# Altium project IOElectro_SimpleOscilloscope.PrjPcb
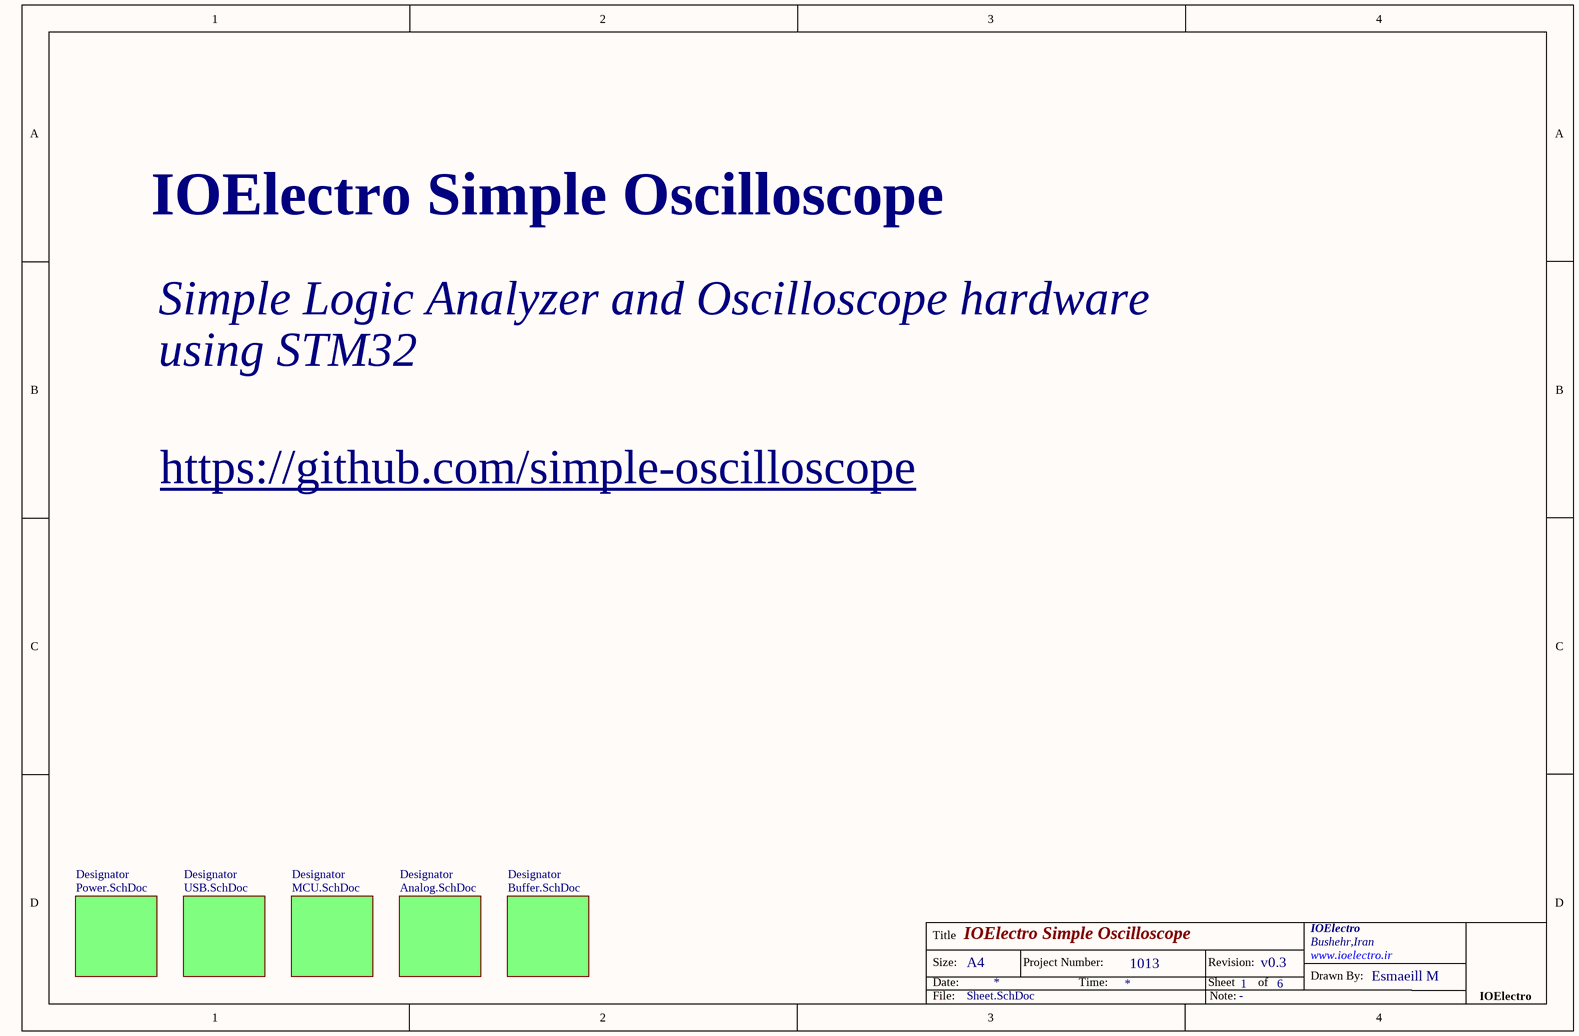
[diagram p0: Sheet.SchDoc]
NF: NF
6 sheets, 108 parts. Net scope: flat (ports and power ports of the same name join across sheets).
Board file: PCB.PcbDoc
Sheets:
  Sheet.SchDoc
    Designator = Power.SchDoc
    Designator = USB.SchDoc
    Designator = MCU.SchDoc
    Designator = Analog.SchDoc
    Designator = Buffer.SchDoc

## Sheet Sheet.SchDoc: IOElectro Simple Oscilloscope
size A4; Author: -; CompanyName: IOElectro; DrawnBy: Esmaeill M; Engineer: -; Organization: IOElectro; Address1: Bushehr,Iran; Address2: www.ioelectro.ir; DocumentNumber: 1; Revision: v0.3; SheetNumber: 1; SheetTotal: 6; ProjectNumber: 1013; Note: -

### Sub-sheets
Designator = Power.SchDoc: no entries
Designator = USB.SchDoc: no entries
Designator = MCU.SchDoc: no entries
Designator = Analog.SchDoc: no entries
Designator = Buffer.SchDoc: no entries

### Notes on the sheet
- IOElectro Simple Oscilloscope
- Simple Logic Analyzer and Oscilloscope hardware
- using STM32
- https://github.com/simple-oscilloscope
- Title
- Size:
- Date:
- A4
- Project Number:
- Time:
- Revision:
- Sheet
- of
- Drawn By:
- IOElectro
- File:
- Note:

## Sheet Power.SchDoc: POWER
size A4; Author: -; CompanyName: IOElectro; DrawnBy: Esmaeill M; Engineer: -; Organization: IOElectro; Address1: Bushehr,Iran; Address2: www.ioelectro.ir; DocumentNumber: 2; Revision: v0.3; SheetNumber: 2; SheetTotal: 6; ProjectNumber: 1013; Note: POWER
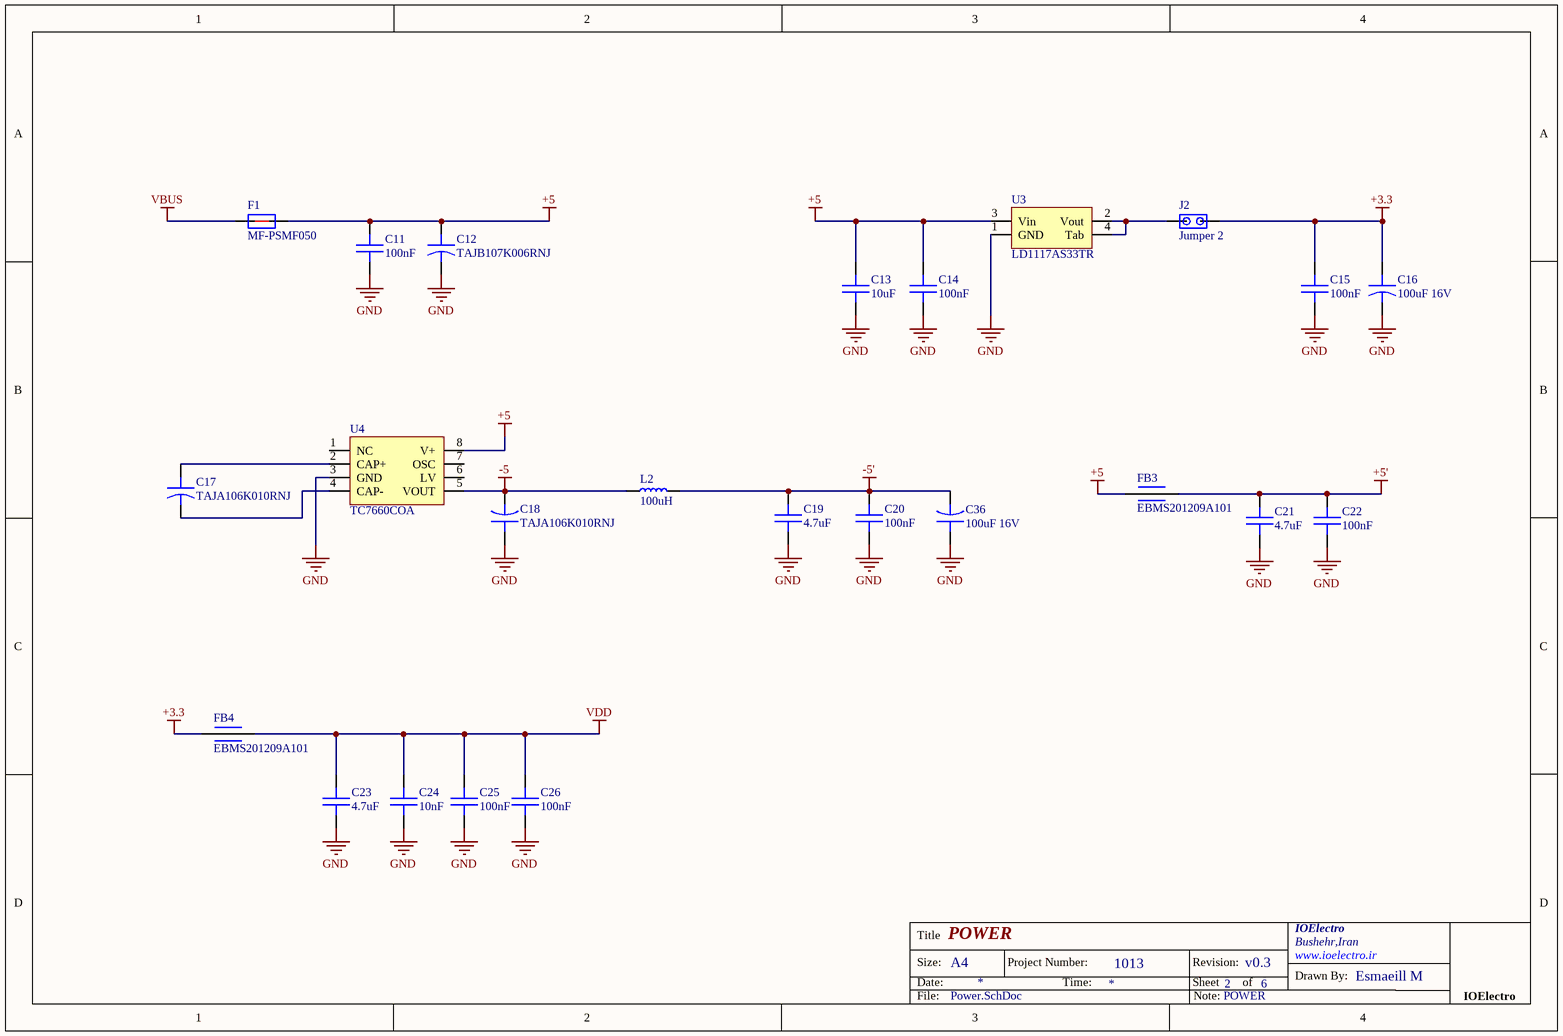
[diagram p1: Power.SchDoc]

### Parts
C11  100nF  [C-0805]
C12  TAJB107K006RNJ  [TAJB]
C13  10uF  [C-0805]
C14  100nF  [C-0805]
C15  100nF  [C-0805]
C16  100uF 16V  [C-EL_6.5x7x2.5mm]
C17  TAJA106K010RNJ  [TAJA]
C18  TAJA106K010RNJ  [TAJA]
C19  4.7uF  [C-0805]
C20  100nF  [C-BP-Ceramic-DIP]
C21  4.7uF  [C-0805]
C22  100nF  [C-BP-Ceramic-DIP]
C23  4.7uF  [C-0805]
C24  10nF  [C-0805]
C25  100nF  [C-0805]
C26  100nF  [C-0805]
C36  100uF 16V  [C-EL_6.5x7x2.5mm]
F1  MF-PSMF050  [MF-PSMF]
FB3  EBMS201209A101  [L-0805]
FB4  EBMS201209A101  [L-0805]
J2  Jumper 2  [JAMPER-2-DIP_2.56mm]
L2  100uH  [L-DIP_3x7mm_pin9mm]
U3  LD1117AS33TR  [SOT-223]
U4  TC7660COA  [SOIC-8]

### Nets
+3.3: C15.1 C16.A FB4.1 J2.1
+5: C11.1 C12.A C13.1 C14.1 F1.2 FB3.1 U3.3(Vin) U4.8(V+)
+5': C21.1 C22.2 FB3.2
-5: C18.K L2.1 U4.5(VOUT)
-5': C19.1 C20.2 C36.K L2.2
GND: C11.2 C12.K C13.2 C14.2 C15.2 C16.K C18.A C19.2 C20.1 C21.2 C22.1 C23.2 C24.2 C25.2 C26.2 C36.A U3.1(GND) U4.3(GND)
VBUS: F1.1
VDD: C23.1 C24.1 C25.1 C26.1 FB4.2
NetC17_A: C17.A U4.2(CAP+)
NetC17_K: C17.K U4.4(CAP-)
NetJ2_2: J2.2 U3.2(Vout) U3.4(Tab)

Not connected (* = marked no-connect by the designer): U4 1(NC) 6(LV) 7(OSC)

### Notes on the sheet
- Title
- Size:
- Date:
- A4
- Project Number:
- Time:
- Revision:
- Sheet
- of
- Drawn By:
- IOElectro
- File:
- Note:

### Library data of the parts
C11 C13-C15 C19 C21 C23-C26 = CAP: SMD 0805
C12 = TAJB107K006RNJ: AVX - TAJB107K006RNJ - Surface Mount Tantalum Capacitor, 100 µF, 6.3 V, 1411 [3528 Metric], TAJ Series, ± 10%, -55 °C; Manufacturer: Kyocera AVX; Capacitance: 100uF; ESR (Equivalent Series Resistance): 1.7R; Voltage Rating (DC): 6.3V; Leakage Current: 6.3uA; Polarity: Polar; Supplier 1: Digi-Key; Manufacturer Part Number: TAJB107K006RNJ; RoHS: Yes; Category: Tantalum Capacitors; Stock 1: 10000; Pricing 1: 1=0/71000, 10=0/52500, 50=0/41980, 100=0/35980, 500=0/28486, 1000=0/23989 (USD); Mount: Surface Mount,PCB; Case/Package: 1210; Dielectric Material: Tantalum; Case Code (Imperial): 1210; Case Code (Metric): 3528; Min Operating Temperature: -55°C; Max Operating Temperature: 125°C; Tolerance: 10%; Packaging: Tape and Reel; Voltage: 6.3V; Voltage Rating: 6.3V; Package Quantity: 1; Termination: SMD/SMT; Dissipation Factor: 10%; Features: General Purpose; Series: TAJ; Construction: Flat; Length: 3.5mm; Width: 2.8mm; Height: 1.9mm; Depth: 2.8mm; Height - Seated (Max): 0.083inch; Radiation Hardening: No; REACH SVHC: No SVHC; Lead Free: Lead Free; RoHS Compliant: Yes; ComponentLink1URL: https://datasheet.ciiva.com/11794/0900766b802e69d0-11794415.pdf?src-supplier=RSComponents; ComponentLink1Description: https://datasheet.ciiva.com/11794/0900766b802e69d0-11794415.pdf?src-supplier=RSComponents; ComponentLink2URL: https://datasheet.ciiva.com/26915/getdatasheetpartid-133381-26915174.pdf?src-supplier=Verical; ComponentLink2Description: https://datasheet.ciiva.com/26915/getdatasheetpartid-133381-26915174.pdf?src-supplier=Verical; ComponentLink3URL: https://datasheet.ciiva.com/18710/taj-eng-18710634.pdf?src-supplier=Distrelec; ComponentLink3Description: https://datasheet.ciiva.com/18710/taj-eng-18710634.pdf?src-supplier=Distrelec; ComponentLink4URL: https://datasheet.ciiva.com/7720/1680476-7720606.pdf?src-supplier=Element14; ComponentLink4Description: https://datasheet.ciiva.com/7720/1680476-7720606.pdf?src-supplier=Element14; ComponentLink5URL: https://datasheet.ciiva.com/7720/1680476-7720607.pdf?src-supplier=Element14; ComponentLink5Description: https://datasheet.ciiva.com/7720/1680476-7720607.pdf?src-supplier=Element14; ComponentLink6URL: https://datasheet.ciiva.com/264/taj-264188.pdf?src-supplier=Digi-Key; ComponentLink6Description: https://datasheet.ciiva.com/264/taj-264188.pdf?src-supplier=Digi-Key; ComponentLink7URL: https://datasheet.ciiva.com/264/taj-264187.pdf?src-supplier=Digi-Key; ComponentLink7Description: https://datasheet.ciiva.com/264/taj-264187.pdf?src-supplier=Digi-Key; ComponentLink8URL: https://datasheet.ciiva.com/264/taj-264189.pdf?src-supplier=Digi-Key; ComponentLink8Description: https://datasheet.ciiva.com/264/taj-264189.pdf?src-supplier=Digi-Key; ComponentLink9URL: https://datasheet.ciiva.com/14602/70001050-14602126.pdf?src-supplier=Allied+Electronics; ComponentLink9Description: https://datasheet.ciiva.com/14602/70001050-14602126.pdf?src-supplier=Allied+Electronics; ComponentLink10URL: https://datasheet.ciiva.com/14599/70001050-14599717.pdf?src-supplier=Allied+Electronics; ComponentLink10Description: https://datasheet.ciiva.com/14599/70001050-14599717.pdf?src-supplier=Allied+Electronics; ComponentLink11URL: https://datasheet.ciiva.com/11224/taj-11224955.pdf?src-supplier=Avnet; ComponentLink11Description: https://datasheet.ciiva.com/11224/taj-11224955.pdf?src-supplier=Avnet; ComponentLink12URL: https://datasheet.ciiva.com/16632/taj-16632597.pdf?src-supplier=Avnet+Europe; ComponentLink12Description: https://datasheet.ciiva.com/16632/taj-16632597.pdf?src-supplier=Avnet+Europe; Supplier Part Number 1: 478-1677-1-ND
C16 C36 = CAP-EL: CAPACITOR ELECTROLYTIC 6.3x7mm
C17 C18 = TAJA106K010RNJ: Capacitor;  Tantalum;  Cap 10 uF;  Tol 10%;  Vol-Rtg 10 VDC;  SMT;  3216;  ESR 3 Ohms;  TR; Manufacturer: Kyocera AVX; Capacitance: 10uF; ESR (Equivalent Series Resistance): 3R; Voltage Rating (DC): 10V; Leakage Current: 1uA; Polarity: Polar; Dissipation Factor: 6%; Q Factor: 6; Supplier 1: Digi-Key; Manufacturer Part Number: TAJA106K010RNJ; RoHS: Yes; Category: Tantalum Capacitors; Stock 1: 7703; Pricing 1: 1=0/34000, 10=0/23400, 50=0/16400, 100=0/14060, 500=0/10544, 1000=0/08903 (USD); Mount: Surface Mount,PCB; Case/Package: 1206; Number of Pins: 2; Case Code (Metric): 3216; Case Code (Imperial): 1206; Dielectric Material: Tantalum; Min Operating Temperature: -55°C; Max Operating Temperature: 125°C; Tolerance: 10%; Packaging: Tape and Reel; Voltage Rating: 10V; Package Quantity: 1; Termination: SMD/SMT; Voltage: 10V; Features: General Purpose; Series: TAJ; Construction: Flat; Length: 3.2mm; Width: 1.6mm; Height: 1.6mm; Height - Seated (Max): 0.071inch; Depth: 1.6mm; Radiation Hardening: No; Lead Free: Lead Free; RoHS Compliant: Yes; REACH SVHC: No SVHC; ComponentLink1URL: https://datasheet.ciiva.com/11793/0900766b80ccdc61-11793042.pdf?src-supplier=RSComponents; ComponentLink1Description: https://datasheet.ciiva.com/11793/0900766b80ccdc61-11793042.pdf?src-supplier=RSComponents; ComponentLink2URL: https://datasheet.ciiva.com/26341/559409-da-01-en-tacc-a-3-2-mm-x-1-6-mm-x-1-6-mm-10-uf-26341749.pdf?src-supplier=Conrad; ComponentLink2Description: https://datasheet.ciiva.com/26341/559409-da-01-en-tacc-a-3-2-mm-x-1-6-mm-x-1-6-mm-10-uf-26341749.pdf?src-supplier=Conrad; ComponentLink3URL: https://datasheet.ciiva.com/26787/taja106k010rnj-26787085.pdf?src-supplier=IIIC; ComponentLink3Description: https://datasheet.ciiva.com/26787/taja106k010rnj-26787085.pdf?src-supplier=IIIC; ComponentLink4URL: https://datasheet.ciiva.com/3004/taj-3004385.pdf?src-supplier=Avnet; ComponentLink4Description: https://datasheet.ciiva.com/3004/taj-3004385.pdf?src-supplier=Avnet; ComponentLink5URL: https://datasheet.ciiva.com/263/taj-263394.pdf?src-supplier=Digi-Key; ComponentLink5Description: https://datasheet.ciiva.com/263/taj-263394.pdf?src-supplier=Digi-Key; ComponentLink6URL: https://datasheet.ciiva.com/3004/taj-3004386.pdf?src-supplier=Avnet; ComponentLink6Description: https://datasheet.ciiva.com/3004/taj-3004386.pdf?src-supplier=Avnet; ComponentLink7URL: https://datasheet.ciiva.com/263/taj-263395.pdf?src-supplier=Digi-Key; ComponentLink7Description: https://datasheet.ciiva.com/263/taj-263395.pdf?src-supplier=Digi-Key; ComponentLink8URL: https://datasheet.ciiva.com/263/taj-263396.pdf?src-supplier=Digi-Key; ComponentLink8Description: https://datasheet.ciiva.com/263/taj-263396.pdf?src-supplier=Digi-Key; ComponentLink9URL: https://datasheet.ciiva.com/7730/1826076-7730709.pdf?src-supplier=Element14; ComponentLink9Description: https://datasheet.ciiva.com/7730/1826076-7730709.pdf?src-supplier=Element14; ComponentLink10URL: https://datasheet.ciiva.com/18710/taj-eng-18710645.pdf?src-supplier=Distrelec; ComponentLink10Description: https://datasheet.ciiva.com/18710/taj-eng-18710645.pdf?src-supplier=Distrelec; ComponentLink11URL: https://datasheet.ciiva.com/7730/1703059-7730710.pdf?src-supplier=Element14; ComponentLink11Description: https://datasheet.ciiva.com/7730/1703059-7730710.pdf?src-supplier=Element14; ComponentLink12URL: https://datasheet.ciiva.com/7730/1826076-7730711.pdf?src-supplier=Element14; ComponentLink12Description: https://datasheet.ciiva.com/7730/1826076-7730711.pdf?src-supplier=Element14; ComponentLink13URL: https://datasheet.ciiva.com/12882/taj-27497-12882583.pdf?src-supplier=Mouser; ComponentLink13Description: https://datasheet.ciiva.com/12882/taj-27497-12882583.pdf?src-supplier=Mouser; ComponentLink14URL: https://datasheet.ciiva.com/5936/2613-5936824.pdf?src-supplier=Farnell; ComponentLink14Description: https://datasheet.ciiva.com/5936/2613-5936824.pdf?src-supplier=Farnell; ComponentLink15URL: https://datasheet.ciiva.com/16486/taj-16486093.pdf?src-supplier=Avnet+Asia; ComponentLink15Description: https://datasheet.ciiva.com/16486/taj-16486093.pdf?src-supplier=Avnet+Asia; ComponentLink16URL: https://datasheet.ciiva.com/14593/70001050-14593951.pdf?src-supplier=Allied+Electronics; ComponentLink16Description: https://datasheet.ciiva.com/14593/70001050-14593951.pdf?src-supplier=Allied+Electronics; Supplier Part Number 1: 478-1654-1-ND
C20 C22 = CAP: Ceramic Disk Capacitor 50V
F1 = MF-PSMF050X-2: BOURNS   MF-PSMF050X-2   FUSE, RESETTABLE PTC, 6V, 500MA, 0805; Number of Terminals/Pins: 2; Max Current Rating: 40A; Power Dissipation: 500mW; Trip Current: 1A; Resistance: 900mR; Time to Trip: 0.1s; Approvals: UL; Supplier 1: Digi-Key; Manufacturer: Bourns; Manufacturer Part Number: MF-PSMF050X-2; RoHS: Yes; Category: PTC Resettable Fuses; Stock 1: 9973; Pricing 1: 1=0/80000, 5=0/78000, 10=0/75600, 50=0/63600, 100=0/52800, 250=0/48000, 500=0/40800, 1000=0/36000 (USD); Mount: Surface Mount,PCB; Case/Package: 0805; Number of Pins: 2; Case Code (Metric): 2012; Case Code (Imperial): 0805; Terminal Material: Gold; Min Operating Temperature: -40°C; Max Operating Temperature: 85°C; Hold Current: 500mA; Packaging: Tape and Reel; Operating Supply Voltage: 6V; Voltage Rating: 6V; Package Quantity: 3000; Current Rating: 40A; Termination: SMD/SMT; Max Power Dissipation: 500mW; Voltage Rating (DC): 6V; Series: MF-PSMF; Length: 2.3mm; Width: 1.5mm; Height: 0.85mm; Radiation Hardening: No; REACH SVHC: No SVHC; RoHS Compliant: Yes; ComponentLink1URL: https://datasheet.ciiva.com/3019/mfpsmf-3019798.pdf?src-supplier=Avnet; ComponentLink1Description: https://datasheet.ciiva.com/3019/mfpsmf-3019798.pdf?src-supplier=Avnet; ComponentLink2URL: https://datasheet.ciiva.com/3019/mfpsmf-3019799.pdf?src-supplier=Avnet; ComponentLink2Description: https://datasheet.ciiva.com/3019/mfpsmf-3019799.pdf?src-supplier=Avnet; ComponentLink3URL: https://datasheet.ciiva.com/22657/1442129-22657847.pdf?src-supplier=Element14; ComponentLink3Description: https://datasheet.ciiva.com/22657/1442129-22657847.pdf?src-supplier=Element14; ComponentLink4URL: https://datasheet.ciiva.com/26946/getdatasheetpartid-137409-26946007.pdf?src-supplier=Verical; ComponentLink4Description: https://datasheet.ciiva.com/26946/getdatasheetpartid-137409-26946007.pdf?src-supplier=Verical; ComponentLink5URL: https://datasheet.ciiva.com/326/mfpsmf-326488.pdf?src-supplier=Digi-Key; ComponentLink5Description: https://datasheet.ciiva.com/326/mfpsmf-326488.pdf?src-supplier=Digi-Key; ComponentLink6URL: https://datasheet.ciiva.com/326/mfpsmf-326489.pdf?src-supplier=Digi-Key; ComponentLink6Description: https://datasheet.ciiva.com/326/mfpsmf-326489.pdf?src-supplier=Digi-Key; ComponentLink7URL: https://datasheet.ciiva.com/326/mfpsmf-326490.pdf?src-supplier=Digi-Key; ComponentLink7Description: https://datasheet.ciiva.com/326/mfpsmf-326490.pdf?src-supplier=Digi-Key; ComponentLink8URL: https://datasheet.ciiva.com/4501/mfpsmf-69505-4501179.pdf?src-supplier=Mouser; ComponentLink8Description: https://datasheet.ciiva.com/4501/mfpsmf-69505-4501179.pdf?src-supplier=Mouser; ComponentLink9URL: https://datasheet.ciiva.com/32430/mf-psmf-series-eng-tds-32430651.pdf?src-supplier=Distrelec; ComponentLink9Description: https://datasheet.ciiva.com/32430/mf-psmf-series-eng-tds-32430651.pdf?src-supplier=Distrelec; ComponentLink10URL: https://datasheet.ciiva.com/1274/1442129-1274589.pdf?src-supplier=Element14; ComponentLink10Description: https://datasheet.ciiva.com/1274/1442129-1274589.pdf?src-supplier=Element14; ComponentLink11URL: https://datasheet.ciiva.com/17401/mfpsmf-17401741.pdf?src-supplier=Avnet+Europe; ComponentLink11Description: https://datasheet.ciiva.com/17401/mfpsmf-17401741.pdf?src-supplier=Avnet+Europe; ComponentLink12URL: https://datasheet.ciiva.com/22712/1442129-22712191.pdf?src-supplier=Element14; ComponentLink12Description: https://datasheet.ciiva.com/22712/1442129-22712191.pdf?src-supplier=Element14; Supplier Part Number 1: MF-PSMF050X-2CT-ND
FB3 FB4 = EBMS201209A101: FERRITE BEAD 0805 100R 100Mhz
J2 = JUMPER-2: 2PIN DIP JAMPER 2.56mm
L2 = AL0307-101K-LF: Axial Lead Inductors(Coils)For Signal Line 100uH 165mA
U3 = LD1117AS33TR: IC REG LINEAR 3.3V 1A SOT223; Manufacturer: STMicroelectronics; Number of Outputs: 1; Max Input Voltage: 10V; Max Power Dissipation: 12W; Quiescent Current: 10mA; Polarity: Positive; Accuracy: 2%; Output Type: Fixed; Max Output Current: 1.2A; Dropout Voltage: 1.15V; Min Input Voltage: 5.3V; Input Bias Current: 5mA; Supplier 1: Digi-Key; Manufacturer Part Number: LD1117AS33TR; RoHS: Yes; Category: Voltage Regulators - Linear; Stock 1: 4724; Pricing 1: 1=0/98000, 10=0/86000, 25=0/80760, 100=0/65920, 250=0/61228, 500=0/52110, 1000=0/43015 (USD); Mount: Surface Mount; Case/Package: SOT-223; Number of Pins: 4; Weight: 0.01lb; Contact Plating: Tin,Matte; Min Operating Temperature: 0°C; Max Operating Temperature: 125°C; Output Voltage: 3.3V; Packaging: Tape and Reel; Output Current: 1A; Nominal Output Voltage: 3.3V; Package Quantity: 1; Number of Regulators: 1; Power Dissipation: 12W; Min Output Voltage: 3.3V; Output Voltage Accuracy: 2%; Series: -; Length: 6.5mm; Width: 3.5mm; Height: 1.8mm; Radiation Hardening: No; REACH SVHC: No SVHC; Lead Free: Lead Free; RoHS Compliant: Yes; ComponentLink1URL: https://datasheet.ciiva.com/7993/1732936-7993322.pdf?src-supplier=Element14; ComponentLink1Description: https://datasheet.ciiva.com/7993/1732936-7993322.pdf?src-supplier=Element14; ComponentLink2URL: https://datasheet.ciiva.com/7993/1732936-7993323.pdf?src-supplier=Element14; ComponentLink2Description: https://datasheet.ciiva.com/7993/1732936-7993323.pdf?src-supplier=Element14; ComponentLink3URL: https://datasheet.ciiva.com/16375/cd00002116-16375420.pdf?src-supplier=Future+Electronics; ComponentLink3Description: https://datasheet.ciiva.com/16375/cd00002116-16375420.pdf?src-supplier=Future+Electronics; ComponentLink4URL: https://datasheet.ciiva.com/2042/cd00002116-2042573.pdf?src-supplier=Digi-Key; ComponentLink4Description: https://datasheet.ciiva.com/2042/cd00002116-2042573.pdf?src-supplier=Digi-Key; ComponentLink5URL: https://datasheet.ciiva.com/2042/cd00002116-2042574.pdf?src-supplier=Digi-Key; ComponentLink5Description: https://datasheet.ciiva.com/2042/cd00002116-2042574.pdf?src-supplier=Digi-Key; ComponentLink6URL: https://datasheet.ciiva.com/2042/cd00002116-2042575.pdf?src-supplier=Digi-Key; ComponentLink6Description: https://datasheet.ciiva.com/2042/cd00002116-2042575.pdf?src-supplier=Digi-Key; Supplier Part Number 1: 497-1228-1-ND
U4 = TC7660COA: IC REG SWTCHD CAP INV 20MA 8SOIC; Manufacturer: Microchip; Output Voltage: -1.5V; Number of Outputs: 1; Min Supply Voltage: 1.5V; Max Supply Voltage: 10V; Efficiency: 98%; Switching Frequency: 10kHz; Synchronous Rectifier: No; Logic Function: Inverting; Min Output Voltage: 3.5V; Max Output Voltage: -10V; Output Power: 470mW; Topology: Charge Pump; Output Type: Fixed; Supplier 1: Digi-Key; Manufacturer Part Number: TC7660COA; RoHS: Yes; Category: Voltage Regulators - Switching; Stock 1: 335; Pricing 1: 1=0/88000, 25=0/73160, 100=0/66780 (USD); Mount: Surface Mount; Case/Package: SOIC; Number of Pins: 8; Weight: 0.006596oz; Contact Plating: Tin,Matte; Min Operating Temperature: 0°C; Max Operating Temperature: 70°C; Output Current: 20mA; Packaging: Rail/Tube; Package Quantity: 100; Max Input Voltage: 10V; Min Input Voltage: 1.5V; Max Output Current: 20mA; Switching Frequency-Max: 10kHz; Length: 4.9mm; Width: 3.91mm; Height: 1.42mm; Radiation Hardening: No; REACH SVHC: No SVHC; Lead Free: Lead Free; RoHS Compliant: Yes; ComponentLink1URL: https://datasheet.ciiva.com/14666/0900766b800a5735-14666575.pdf?src-supplier=RSComponents; ComponentLink1Description: https://datasheet.ciiva.com/14666/0900766b800a5735-14666575.pdf?src-supplier=RSComponents; ComponentLink2URL: https://datasheet.ciiva.com/41463/001085694-da-01-en-ic-reg-switchd-cap-tc7660coa-soic-8-mcp-41463379.pdf?src-supplier=Conrad; ComponentLink2Description: https://datasheet.ciiva.com/41463/001085694-da-01-en-ic-reg-switchd-cap-tc7660coa-soic-8-mcp-41463379.pdf?src-supplier=Conrad; ComponentLink3URL: https://datasheet.ciiva.com/2029/filehandler-aspxddocname-en011631-2029173.pdf?src-supplier=Digi-Key; ComponentLink3Description: https://datasheet.ciiva.com/2029/filehandler-aspxddocname-en011631-2029173.pdf?src-supplier=Digi-Key; ComponentLink4URL: https://datasheet.ciiva.com/16211/filehandler-aspxddocname-en011631-16211183.pdf?src-supplier=Future+Electronics; ComponentLink4Description: https://datasheet.ciiva.com/16211/filehandler-aspxddocname-en011631-16211183.pdf?src-supplier=Future+Electronics; Supplier Part Number 1: TC7660COA-ND

## Sheet USB.SchDoc: USB
size A4; Author: -; CompanyName: IOElectro; DrawnBy: Esmaeill M; Engineer: -; Organization: IOElectro; Address1: Bushehr,Iran; Address2: www.ioelectro.ir; DocumentNumber: 3; Revision: v0.3; SheetNumber: 3; SheetTotal: 6; ProjectNumber: 1013; Note: USB
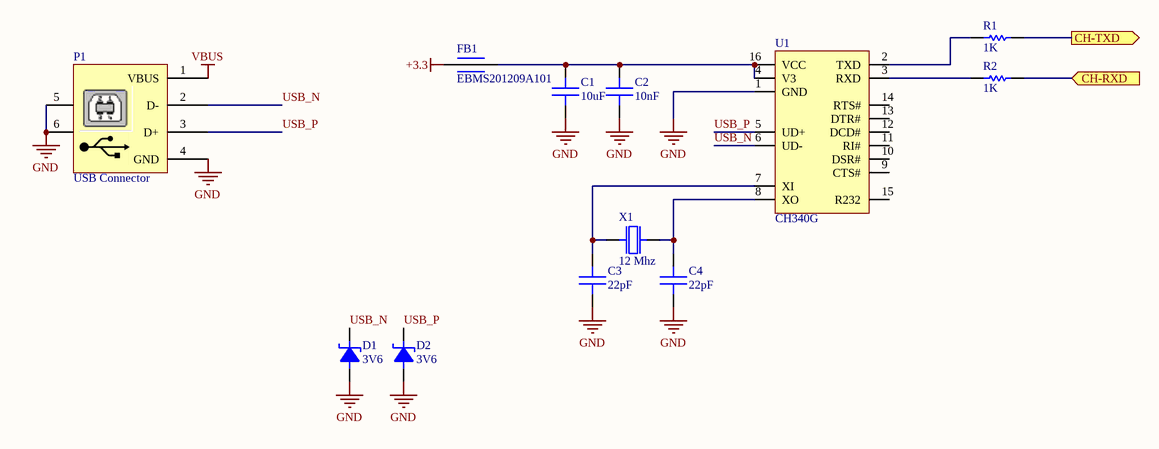
[diagram p2: USB.SchDoc]

### Parts
C1  10uF  [C-0805]
C2  10nF  [C-0805]
C3  22pF  [C-0805]
C4  22pF  [C-0805]
D1  3V6  [SOD80]
D2  3V6  [SOD80]
FB1  EBMS201209A101  [L-0805]
P1  USB Connector  [USB2.5-2H4E]
R1  1K  [R-0805]
R2  1K  [R-0805]
U1  CH340G  [SOP-16]
X1  12 Mhz  [XTAL-DIP_Small]

### Ports
CH-RXD (in), CH-TXD (out)

### Nets
+3.3: FB1.1
GND: C1.2 C2.2 C3.2 C4.2 D1.A D2.A P1.4(GND) P1.5 P1.6 U1.1(GND)
VBUS: P1.1(VBUS)
USB_N: D1.K P1.2(D-) U1.6(UD-)
USB_P: D2.K P1.3(D+) U1.5(UD+)
NetC1_1: C1.1 C2.1 FB1.2 U1.4(V3) U1.16(VCC)
NetC3_1: C3.1 U1.7(XI) X1.2
NetC4_1: C4.1 U1.8(XO) X1.1
NetR1_1: R1.1 U1.2(TXD)
NetR1_2: R1.2 ; port CH-TXD
NetR2_1: R2.1 U1.3(RXD)
NetR2_2: R2.2 ; port CH-RXD

Not connected (* = marked no-connect by the designer): U1 9(CTS#) 10(DSR#) 11(RI#) 12(DCD#) 13(DTR#) 14(RTS#) 15(R232)

### Notes on the sheet
- Title
- Size:
- Date:
- A4
- Project Number:
- Time:
- Revision:
- Sheet
- of
- Drawn By:
- IOElectro
- File:
- Note:

### Library data of the parts
C1-C4 = CAP: SMD 0805
D1 D2 = DIODE-Z: SMD MiniMELF
FB1 = EBMS201209A101: FERRITE BEAD 0805 100R 100Mhz
P1 = USB-B: USB Connector-B Type; Designer: Eng. Saeid Jorablo; Company: DASE Co; Adding Date: 10/26/2010
R1 R2 = RES: 0805
U1 = CH340G: IC USB to Serial; Case/Package: MSOP-10
X1 = XTAL: Crystal oscillator

## Sheet MCU.SchDoc: MCU
size A4; Author: -; CompanyName: IOElectro; DrawnBy: Esmaeill M; Engineer: -; Organization: IOElectro; Address1: Bushehr,Iran; Address2: www.ioelectro.ir; DocumentNumber: 4; Revision: v0.3; SheetNumber: 4; SheetTotal: 6; ProjectNumber: 1013; Note: MCU
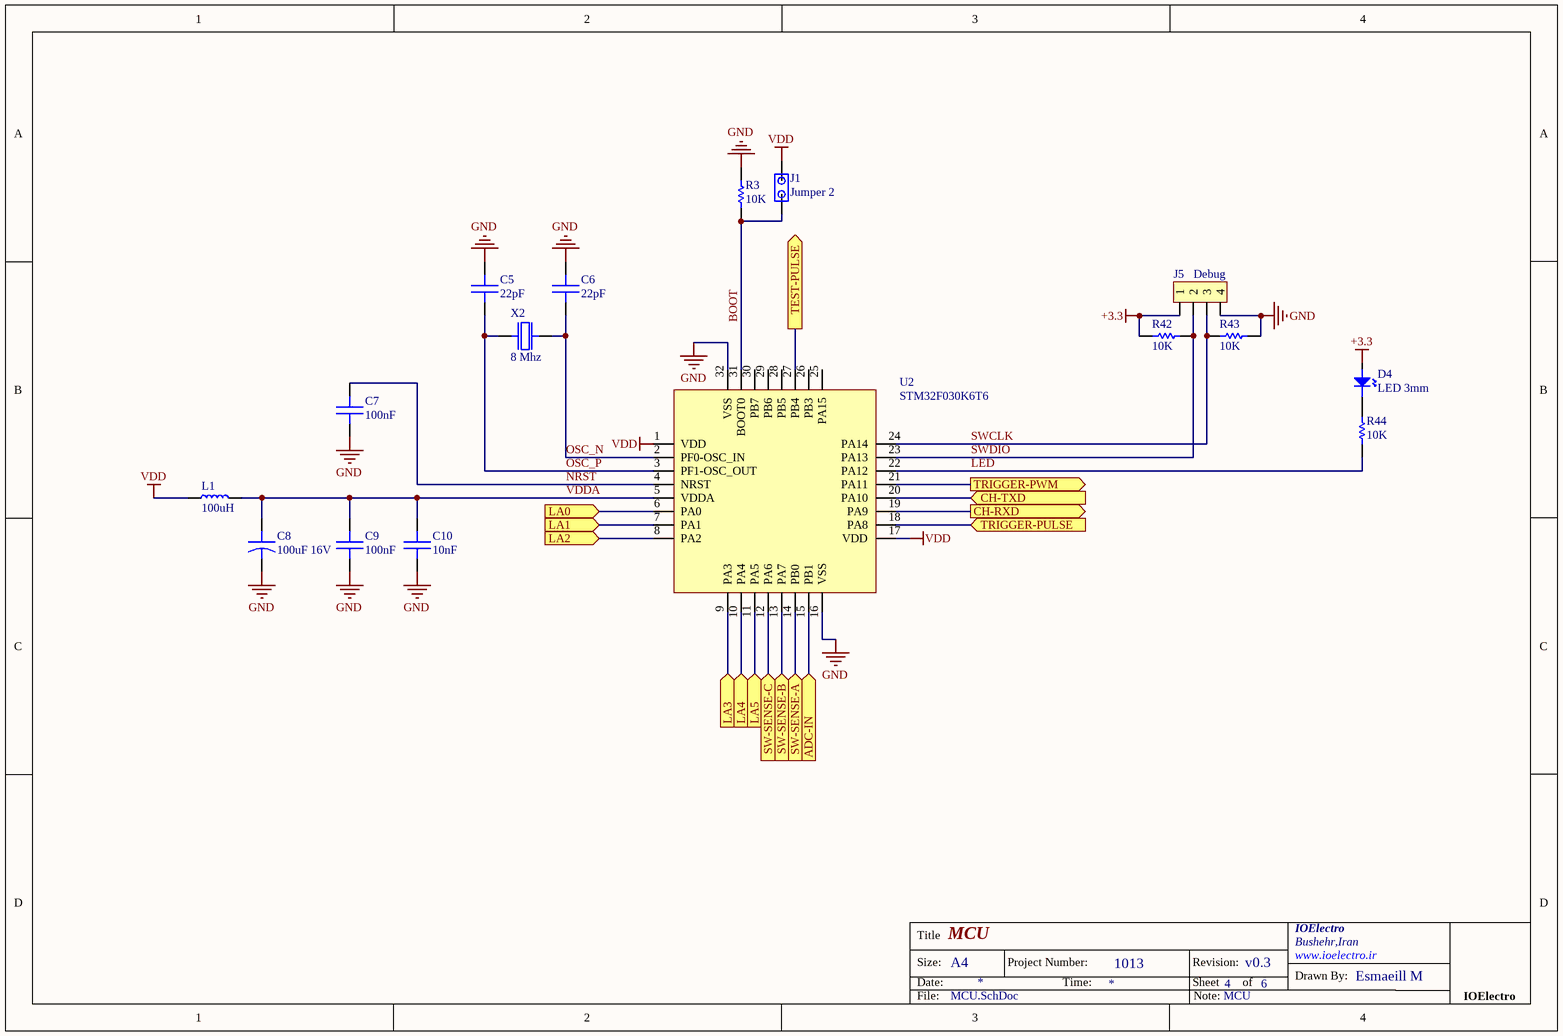
[diagram p3: MCU.SchDoc]

### Parts
C5  22pF  [C-0805]
C6  22pF  [C-0805]
C7  100nF  [C-0805]
C8  100uF 16V  [C-EL_6.5x7x2.5mm]
C9  100nF  [C-0805]
C10  10nF  [C-0805]
D4  LED 3mm  [LED-3MM]
J1  Jumper 2  [JAMPER-2-DIP_2.56mm]
J5  Debug  [PH-1X4]
L1  100uH  [L-DIP_3x7mm_pin9mm]
R3  10K  [R-0805]
R42  10K  [R-0805]
R43  10K  [R-0805]
R44  10K  [R-0805]
U2  STM32F030K6T6  [LQFP-32]
X2  8 Mhz  [XTAL-DIP_Small]

### Ports
ADC-IN (in), CH-RXD (out), CH-TXD (in), LA0 (in), LA1 (in), LA2 (in), LA3 (in), LA4 (in), LA5 (in), SW-SENSE-A (in), SW-SENSE-B (in), SW-SENSE-C (in), TEST-PULSE (out), TRIGGER-PULSE (in), TRIGGER-PWM (out)

### Nets
+3.3: D4.A J5.1 R42.1
GND: C5.2 C6.2 C7.2 C8.K C9.2 C10.2 J5.4 R3.2 R43.2 U2.16(VSS) U2.32(VSS)
VDD: J1.2 L1.1 U2.1(VDD) U2.17(VDD)
BOOT: J1.1 R3.1 U2.31(BOOT0)
LED: R44.2 U2.22(PA12)
NRST: C7.1 U2.4(NRST)
OSC_N: C6.1 U2.2(PF0-OSC_IN) X2.2
OSC_P: C5.1 U2.3(PF1-OSC_OUT) X2.1
SWCLK: J5.3 R43.1 U2.24(PA14)
SWDIO: J5.2 R42.2 U2.23(PA13)
VDDA: C8.A C9.1 C10.1 L1.2 U2.5(VDDA)
NetC30_1: U2.15(PB1) ; port ADC-IN
NetD4_K: D4.K R44.1
NetQ1_3: U2.18(PA8) ; port TRIGGER-PULSE
NetR1_2: U2.20(PA10) ; port CH-TXD
NetR2_2: U2.19(PA9) ; port CH-RXD
NetR21_2: U2.21(PA11) ; port TRIGGER-PWM
NetR24_2: U2.6(PA0) ; port LA0
NetR25_2: U2.7(PA1) ; port LA1
NetR26_2: U2.8(PA2) ; port LA2
NetR27_2: U2.9(PA3) ; port LA3
NetR28_2: U2.10(PA4) ; port LA4
NetR29_2: U2.11(PA5) ; port LA5
NetSW1_6: U2.14(PB0) ; port SW-SENSE-A
NetSW2_6: U2.13(PA7) ; port SW-SENSE-B
NetSW3_6: U2.12(PA6) ; port SW-SENSE-C
NetU2_27: U2.27(PB4) ; port TEST-PULSE

Not connected (* = marked no-connect by the designer): U2 25(PA15) 26(PB3) 28(PB5) 29(PB6) 30(PB7)

### Notes on the sheet
- Title
- Size:
- Date:
- A4
- Project Number:
- Time:
- Revision:
- Sheet
- of
- Drawn By:
- IOElectro
- File:
- Note:

### Library data of the parts
C5-C7 C9 C10 = CAP: SMD 0805
C8 = CAP-EL: CAPACITOR ELECTROLYTIC 6.3x7mm
D4 = LED
J1 = JUMPER-2: 2PIN DIP JAMPER 2.56mm
J5 = PH-1X4: PIN HEADER 1x4 2.56mm
L1 = AL0307-101K-LF: as L2 on sheet Power
R3 R42-R44 = RES: 0805
U2 = STM32F030K6T6: STMICROELECTRONICS - STM32F030K6T6 - ARM MCU, Value Line, STM32 Family STM32F0 Series Microcontrollers, ARM Cortex-M0, 32bit, 48 MHz; Interface: I2C,SPI,UART,USART; Operating Supply Voltage: 3.3V; Data Bus Width: 32b; Memory Type: FLASH; Frequency: 48MHz; RAM Size: 4KB; Max Supply Voltage: 3.6V; Max Power Dissipation: 357mW; Number of I/Os: 26; Number of Timers/Counters: 5; Min Supply Voltage: 2.4V; Oscillator Type: Internal; Number of ADC Channels: 12; Number of SPI Channels: 1; Watchdog Timer: Yes; Memory Size: 32KB; Peripherals: POR,PWM,WDT,DMA; Supplier 1: Digi-Key; Manufacturer: STMicroelectronics; Manufacturer Part Number: STM32F030K6T6; RoHS: Yes; Category: Microcontrollers; Pricing 1: 1=1/84000, 10=1/65000, 25=1/55640, 80=1/32600, 250=1/24512, 500=1/08948, 1000=1/03760 (USD); Case/Package: LQFP; Number of Pins: 32; Weight: 0.027302oz; Contact Plating: Tin; Min Operating Temperature: -40°C; Max Operating Temperature: 85°C; Package Quantity: 250; Packaging: Tray; Core Architecture: ARM; Max Frequency: 48MHz; Number of I2C Channels: 1; Number of Programmable I/O: 26; Length: 7.2mm; Width: 7.2mm; Height: 1.45mm; Radiation Hardening: No; REACH SVHC: No SVHC; Lead Free: Lead Free; RoHS Compliant: Yes; ComponentLink1URL: https://datasheet.ciiva.com/29987/dm00088500-29987017.pdf?src-supplier=Avnet; ComponentLink1Description: https://datasheet.ciiva.com/29987/dm00088500-29987017.pdf?src-supplier=Avnet; ComponentLink2URL: https://datasheet.ciiva.com/46427/1792126-46427291.pdf?src-supplier=Element14; ComponentLink2Description: https://datasheet.ciiva.com/46427/1792126-46427291.pdf?src-supplier=Element14; Supplier Part Number 1: 497-14046-ND
X2 = XTAL: Crystal oscillator

## Sheet Analog.SchDoc: Analog
size A4; Author: -; CompanyName: IOElectro; DrawnBy: Esmaeill M; Engineer: -; Organization: IOElectro; Address1: Bushehr,Iran; Address2: www.ioelectro.ir; DocumentNumber: 5; Revision: v0.3; SheetNumber: 5; SheetTotal: 6; ProjectNumber: 1013; Note: Analog module
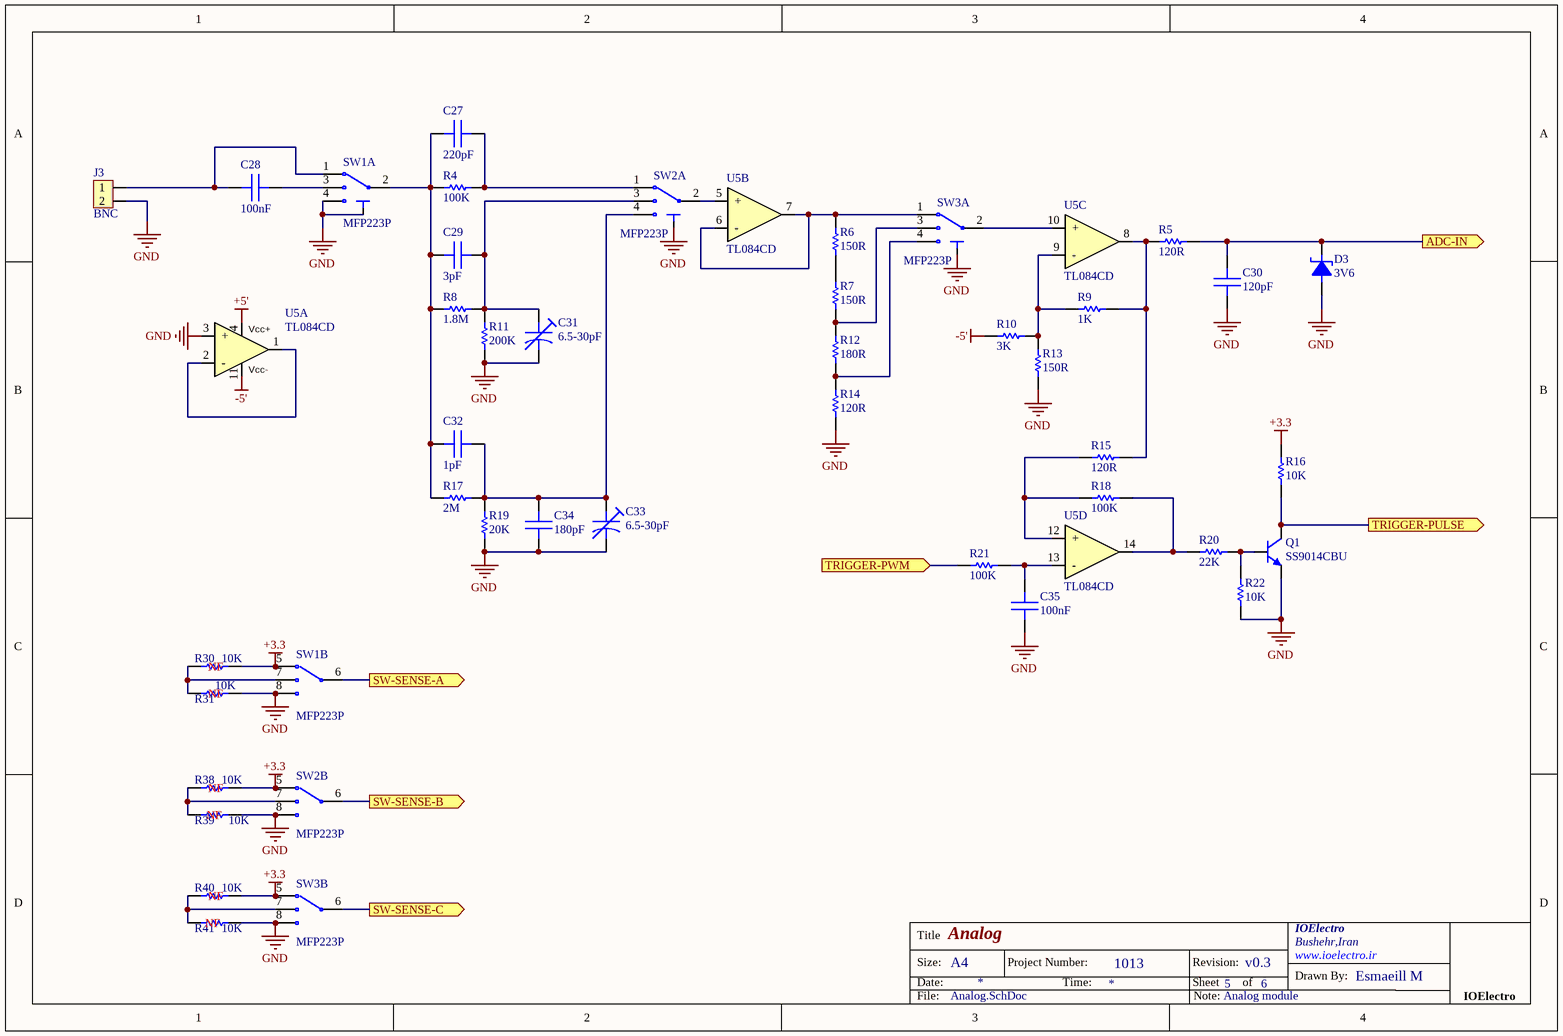
[diagram p4: Analog.SchDoc]

### Parts
C27  220pF  [C-BP-Ceramic-DIP]
C28  100nF  [C-BP-Ceramic-DIP]
C29  3pF  [C-BP-Ceramic-DIP]
C30  120pF  [C-BP-Ceramic-DIP]
C31  6.5-30pF  [C-TR-DIP_5mm]
C32  1pF  [C-BP-Ceramic-DIP]
C33  6.5-30pF  [C-TR-DIP_5mm]
C34  180pF  [C-BP-Ceramic-DIP]
C35  100nF  [C-BP-Ceramic-DIP]
D3  3V6  [SOD80]
J3  BNC  [PH-1X2-N3D]
Q1  SS9014CBU  [TO-92]
R4  100K  [R-1/4W-DIP-Blue]
R5  120R  [R-1/4W-DIP-Blue]
R6  150R  [R-1/4W-DIP-Blue]
R7  150R  [R-1/4W-DIP-Blue]
R8  1.8M  [R-1/4W-DIP-Blue]
R9  1K  [R-1/4W-DIP-Blue]
R10  3K  [R-1/4W-DIP-Blue]
R11  200K  [R-1/4W-DIP-Blue]
R12  180R  [R-1/4W-DIP-Blue]
R13  150R  [R-1/4W-DIP-Blue]
R14  120R  [R-1/4W-DIP-Blue]
R15  120R  [R-1/4W-DIP-Blue]
R16  10K  [R-0805]
R17  2M  [R-1/4W-DIP-Blue]
R18  100K  [R-1/4W-DIP-Blue]
R19  20K  [R-1/4W-DIP-Blue]
R20  22K  [R-0805]
R21  100K  [R-1/4W-DIP-Blue]
R22  10K  [R-0805]
R30  10K  [R-0805]
R31  10K  [R-0805]
R38  10K  [R-0805]
R39  10K  [R-0805]
R40  10K  [R-0805]
R41  10K  [R-0805]
SW1  MFP223P  [MFP223P]  (parts A,B of 2)
SW2  MFP223P  [MFP223P]  (parts A,B of 2)
SW3  MFP223P  [MFP223P]  (parts A,B of 2)
U5  TL084CD  [SO-14]  (parts A,B,C,D of 4)

### Ports
ADC-IN (out), SW-SENSE-A (out), SW-SENSE-B (out), SW-SENSE-C (out), TRIGGER-PULSE (out), TRIGGER-PWM (in)

### Nets
+3.3: R16.2 R30.1 R38.1 R40.1 SW1.5 SW2.5 SW3.5
+5': U5.4(Vcc+)
-5': R10.1 U5.11(Vcc-)
GND: C30.2 C31.K C33.K C34.2 C35.2 D3.A J3.2 Q1.1(E) R11.1 R13.2 R14.1 R19.1 R22.1 R31.1 R39.1 R41.1 SW1.0 SW1.4 SW1.8 SW2.0 SW2.8 SW3.0 SW3.8 U5.3(+)
NetC27_1: C27.1 R4.2 SW2.1
NetC27_2: C27.2 C29.2 C32.2 R4.1 R8.1 R17.1 SW1.2
NetC28_1: C28.1 SW1.3
NetC28_2: C28.2 J3.1 SW1.1
NetC29_1: C29.1 C31.A R8.2 R11.2 SW2.3
NetC30_1: C30.1 D3.K R5.1 ; port ADC-IN
NetC32_1: C32.1 C33.A C34.1 R17.2 R19.2 SW2.4
NetC35_1: C35.1 R21.1 U5.13(-)
NetQ1_2: Q1.2(B) R20.1 R22.2
NetQ1_3: Q1.3(C) R16.1 ; port TRIGGER-PULSE
NetR5_2: R5.2 R9.1 R15.1 U5.8(O)
NetR6_1: R6.1 R7.2
NetR6_2: R6.2 SW3.1 U5.6(-) U5.7(O)
NetR7_1: R7.1 R12.2 SW3.3
NetR9_2: R9.2 R10.2 R13.1 U5.9(-)
NetR12_1: R12.1 R14.2 SW3.4
NetR15_2: R15.2 R18.2 U5.12(+)
NetR18_1: R18.1 R20.2 U5.14(O)
NetR21_2: R21.2 ; port TRIGGER-PWM
NetR30_2: R30.2 R31.2 SW1.7
NetR38_2: R38.2 R39.2 SW2.7
NetR40_2: R40.2 R41.2 SW3.7
NetSW1_6: SW1.6 ; port SW-SENSE-A
NetSW2_2: SW2.2 U5.5(+)
NetSW2_6: SW2.6 ; port SW-SENSE-B
NetSW3_2: SW3.2 U5.10(+)
NetSW3_6: SW3.6 ; port SW-SENSE-C
NetU5_1: U5.1(O) U5.2(-)

### Notes on the sheet
- Title
- Size:
- Date:
- A4
- Project Number:
- Time:
- Revision:
- Sheet
- of
- Drawn By:
- IOElectro
- File:
- Note:

### Library data of the parts
C27-C30 C32 C34 C35 = CAP: Ceramic Disk Capacitor 50V
C31 C33 = GKG30015: Trimmer / Variable Capacitors 6.5-30pF 100V 85 DEG; Manufacturer: Sprague Goodman; Q Factor: 300; Supplier 1: Digi-Key; Manufacturer Part Number: GKG30015; RoHS: Yes; Category: Trimmer / Variable Capacitors; Mount: Through Hole; Min Operating Temperature: -25°C; Max Operating Temperature: 85°C; Package Quantity: 500; Voltage Rating: 100V; Packaging: Bulk; Termination: Snap in; Resistor Type: Ceramic; Voltage Rating (DC): 100V; Features: General Purpose; Series: SURFTRIM® GKG; Length: 6mm; Height: 0.2inch; Lead Pitch: 0.24inch; Height - Seated (Max): 0.197inch; RoHS Compliant: Yes; Lead Free: Lead Free; ComponentLink1URL: http://www.mouser.com/catalog/specsheets/659305J.pdf?src-supplier=Mouser; ComponentLink1Description: http://www.mouser.com/catalog/specsheets/659305J.pdf?src-supplier=Mouser; ComponentLink2URL: https://media.digikey.com/pdf/Data%20Sheets/Sprague-Goodman%20PDFs/Ceramic%20Dielectric%20Trimmer%20Caps.pdf?src-supplier=Digi-Key; ComponentLink2Description: https://media.digikey.com/pdf/Data%20Sheets/Sprague-Goodman%20PDFs/Ceramic%20Dielectric%20Trimmer%20Caps.pdf?src-supplier=Digi-Key; ComponentLink3URL: http://www.spraguegoodman.com/pdfs/305.pdf?src-supplier=Digi-Key; ComponentLink3Description: http://www.spraguegoodman.com/pdfs/305.pdf?src-supplier=Digi-Key; Supplier Part Number 1: SG30015-ND
D3 = DIODE-Z: SMD MiniMELF
J3 = PH-1X2: PIN HEADER 1x2 2.56mm
Q1 = SS9014CBU: Bipolar (BJT) Single Transistor, NPN, 45 V, 270 MHz, 450 mW, 100 mA, 200; Manufacturer: ON Semiconductor; Max Power Dissipation: 450mW; Frequency: 270MHz; Number of Elements: 1; Collector Emitter Voltage (VCEO): 45V; hFE Min: 60; Max Collector Current: 100mA; Collector Base Voltage (VCBO): 50V; Emitter Base Voltage (VEBO): 5V; Collector Emitter Saturation Voltage: 140mV; Collector-emitter Voltage-Max: 300mV; Supplier 1: Digi-Key; Manufacturer Part Number: SS9014CBU; Category: BJTs; Mount: Through Hole; Case/Package: TO-92; Number of Pins: 3; Weight: 0.179g; Min Operating Temperature: -55°C; Max Operating Temperature: 150°C; Packaging: Bulk; Package Quantity: 1000; Transition Frequency: 270MHz; Polarity: NPN; Power Dissipation: 450mW; Collector Emitter Breakdown Voltage: 45V; Element Configuration: Single; Gain Bandwidth Product: 270MHz; Max Frequency: 270MHz; Voltage Rating (DC): 45V; Current Rating: 100mA; Series: -; Length: 4.58mm; Width: 3.86mm; Height: 4.58mm; Radiation Hardening: No; REACH SVHC: No SVHC; Lead Free: Lead Free; RoHS Compliant: Yes; ComponentLink1URL: https://datasheet.ciiva.com/11207/ss9014-11207537.pdf?src-supplier=Avnet; ComponentLink1Description: https://datasheet.ciiva.com/11207/ss9014-11207537.pdf?src-supplier=Avnet; ComponentLink2URL: https://datasheet.ciiva.com/46415/1863528-46415612.pdf?src-supplier=Element14; ComponentLink2Description: https://datasheet.ciiva.com/46415/1863528-46415612.pdf?src-supplier=Element14; ComponentLink3URL: https://datasheet.ciiva.com/978/ss9014-978974.pdf?src-supplier=Digi-Key; ComponentLink3Description: https://datasheet.ciiva.com/978/ss9014-978974.pdf?src-supplier=Digi-Key; ComponentLink4URL: http://datasheet.octopart.com/SS9014CBU-Fairchild-datasheet-4532.pdf?src-supplier=Newark; ComponentLink4Description: http://datasheet.octopart.com/SS9014CBU-Fairchild-datasheet-4532.pdf?src-supplier=Newark; ComponentLink5URL: http://datasheet.octopart.com/SS9014CBU-ON-Semiconductor-datasheet-85608206.pdf?src-supplier=ON+Semiconductor; ComponentLink5Description: http://datasheet.octopart.com/SS9014CBU-ON-Semiconductor-datasheet-85608206.pdf?src-supplier=ON+Semiconductor; ComponentLink6URL: http://datasheet.octopart.com/SS9014CBU-ON-Semiconductor-datasheet-86698737.pdf?src-supplier=ON+Semiconductor; ComponentLink6Description: http://datasheet.octopart.com/SS9014CBU-ON-Semiconductor-datasheet-86698737.pdf?src-supplier=ON+Semiconductor; ComponentLink7URL: http://datasheet.octopart.com/SS9014CBU-ON-Semiconductor-datasheet-102168068.pdf?src-supplier=ON+Semiconductor; ComponentLink7Description: http://datasheet.octopart.com/SS9014CBU-ON-Semiconductor-datasheet-102168068.pdf?src-supplier=ON+Semiconductor; ComponentLink8URL: http://datasheet.octopart.com/SS9014CBU-ON-Semiconductor-datasheet-86693094.pdf?src-supplier=Element14; ComponentLink8Description: http://datasheet.octopart.com/SS9014CBU-ON-Semiconductor-datasheet-86693094.pdf?src-supplier=Element14; ComponentLink9URL: http://sigma.octopart.com/8329026/technical_drawing/Fairchild-Semiconductor-SS9014CBU.pdf?src-supplier=Fairchild+Semiconductor; ComponentLink9Description: http://sigma.octopart.com/8329026/technical_drawing/Fairchild-Semiconductor-SS9014CBU.pdf?src-supplier=Fairchild+Semiconductor; ComponentLink10URL: http://datasheet.octopart.com/SS9014CBU-Fairchild-Semiconductor-datasheet-67476720.pdf?src-supplier=Newark; ComponentLink10Description: http://datasheet.octopart.com/SS9014CBU-Fairchild-Semiconductor-datasheet-67476720.pdf?src-supplier=Newark; ComponentLink11URL: http://datasheet.octopart.com/SS9014CBU-Fairchild-Semiconductor-datasheet-68342036.pdf?src-supplier=Farnell; ComponentLink11Description: http://datasheet.octopart.com/SS9014CBU-Fairchild-Semiconductor-datasheet-68342036.pdf?src-supplier=Farnell; ComponentLink12URL: http://datasheet.octopart.com/SS9014CBU-Fairchild-Semiconductor-datasheet-68481733.pdf?src-supplier=Newark; ComponentLink12Description: http://datasheet.octopart.com/SS9014CBU-Fairchild-Semiconductor-datasheet-68481733.pdf?src-supplier=Newark; ComponentLink13URL: http://datasheet.octopart.com/SS9014CBU-Fairchild-Semiconductor-datasheet-68661175.pdf?src-supplier=Farnell; ComponentLink13Description: http://datasheet.octopart.com/SS9014CBU-Fairchild-Semiconductor-datasheet-68661175.pdf?src-supplier=Farnell; ComponentLink14URL: http://datasheet.octopart.com/SS9014CBU-Fairchild-Semiconductor-datasheet-78857804.pdf?src-supplier=Farnell; ComponentLink14Description: http://datasheet.octopart.com/SS9014CBU-Fairchild-Semiconductor-datasheet-78857804.pdf?src-supplier=Farnell; ComponentLink15URL: http://datasheet.octopart.com/SS9014CBU-Fairchild-Semiconductor-datasheet-78861914.pdf?src-supplier=Newark; ComponentLink15Description: http://datasheet.octopart.com/SS9014CBU-Fairchild-Semiconductor-datasheet-78861914.pdf?src-supplier=Newark; Supplier Part Number 1: SS9014CBU-ND
R4-R15 R17-R19 R21 = RES: Resistor DIP 1/4W 1%
R16 R20 R22 R30 R31 R38-R41 = RES: 0805
SW1-SW3 = MFP223P: Switch Slide ON ON ON Extended Top Slide 0.35A 30VDC 10000Cycle PC Pins Bracket Mount/Through Hole; Manufacturer: Knitter-Switch; Mechanical Life: 10000Cycles; Actuator Material: Polyoxymethylene; Max Voltage Rating (DC): 30V; Max Current Rating: 200mA; Supplier 1: Arrow Europe; Manufacturer Part Number: MFP223P; RoHS: Yes; Category: Uncategorized; Mount: Through Hole,Brackets; Contact Material: Copper Alloy; Contact Plating: Nickel,Silver; Housing Material: Resin; Min Operating Temperature: -20°C; Max Operating Temperature: 85°C; Termination: PC Pins; Length: 16mm; Depth: 6.5mm; Radiation Hardening: No; Lead Free: Lead Free; RoHS Compliant: Yes; ComponentLink1URL: https://datasheet.ciiva.com/26847/getdatasheetpartid-740636-26847254.pdf?src-supplier=Verical; ComponentLink1Description: https://datasheet.ciiva.com/26847/getdatasheetpartid-740636-26847254.pdf?src-supplier=Verical; Supplier Part Number 1: MFP223P
U5 = TL084CD: IC OPAMP JFET 4MHZ 14SO; Manufacturer: STMicroelectronics; Operating Supply Voltage: 18V; Max Supply Voltage: 36V; Dual Supply Voltage: 15V; Voltage Gain: 106.02dB; Slew Rate: 16V/µs; Number of Channels: 4; Common Mode Rejection Ratio: 70dB; Min Dual Supply Voltage: 3V; Output Current: 40mA; Nominal Supply Current: 2.5mA; Min Input Voltage: -12V; Input Bias Current: 200pA; Input Offset Voltage (Vos): 10mV; Operating Supply Current: 1.4mA; Power Dissipation: 680mW; Rise Time: 50ns; Amplifier Type: GENERAL PURPOSE; Supplier 1: Digi-Key; Manufacturer Part Number: TL084CD; RoHS: Yes; Category: Amplifiers - Audio; Stock 1: 3951; Pricing 1: 1=0/56000, 10=0/47700, 25=0/44520, 100=0/35620, 250=0/33072, 500=0/27984, 1000=0/21624, 2500=0/21000 (USD); Mount: Surface Mount; Case/Package: SOIC; Number of Pins: 14; Weight: 0.01lb; Min Operating Temperature: 0°C; Max Operating Temperature: 70°C; Package Quantity: 50; Packaging: Rail/Tube; Unity Gain Bandwidth Product: 4MHz; Max Dual Supply Voltage: 18V; Bandwidth: 4MHz; Max Input Voltage: 15V; Number of Circuits: 4; Gain Bandwidth Product: 4MHz; Output Current per Channel: 40mA; Number of Elements: 4; Number of Amplifiers: 4; Supply Current: 2.5mA; Technology: BIFET; Input Offset Voltage-Max: 10mV; Slew Rate-Nom: 16V/µs; Length: 8.75mm; Width: 4mm; Height: 1.65mm; Radiation Hardening: No; REACH SVHC: No SVHC; Lead Free: Lead Free; RoHS Compliant: Yes; ComponentLink1URL: https://datasheet.ciiva.com/15129/getdatasheetpartid-40720-15129705.pdf?src-supplier=Verical; ComponentLink1Description: https://datasheet.ciiva.com/15129/getdatasheetpartid-40720-15129705.pdf?src-supplier=Verical; ComponentLink2URL: https://datasheet.ciiva.com/29306/155629-da-01-en-op-verst-tl084cd-stm-29306876.pdf?src-supplier=Conrad; ComponentLink2Description: https://datasheet.ciiva.com/29306/155629-da-01-en-op-verst-tl084cd-stm-29306876.pdf?src-supplier=Conrad; ComponentLink3URL: https://datasheet.ciiva.com/1796/cd00000493-1796695.pdf?src-supplier=Digi-Key; ComponentLink3Description: https://datasheet.ciiva.com/1796/cd00000493-1796695.pdf?src-supplier=Digi-Key; ComponentLink4URL: https://datasheet.ciiva.com/16385/cd00000493-16385768.pdf?src-supplier=Future+Electronics; ComponentLink4Description: https://datasheet.ciiva.com/16385/cd00000493-16385768.pdf?src-supplier=Future+Electronics; Supplier Part Number 1: 497-TL084CD-ND

## Sheet Buffer.SchDoc: Buffer
size A4; Author: -; CompanyName: IOElectro; DrawnBy: Esmaeill M; Engineer: -; Organization: IOElectro; Address1: Bushehr,Iran; Address2: www.ioelectro.ir; DocumentNumber: 6; Revision: v0.3; SheetNumber: 6; SheetTotal: 6; ProjectNumber: 1013; Note: Buffer
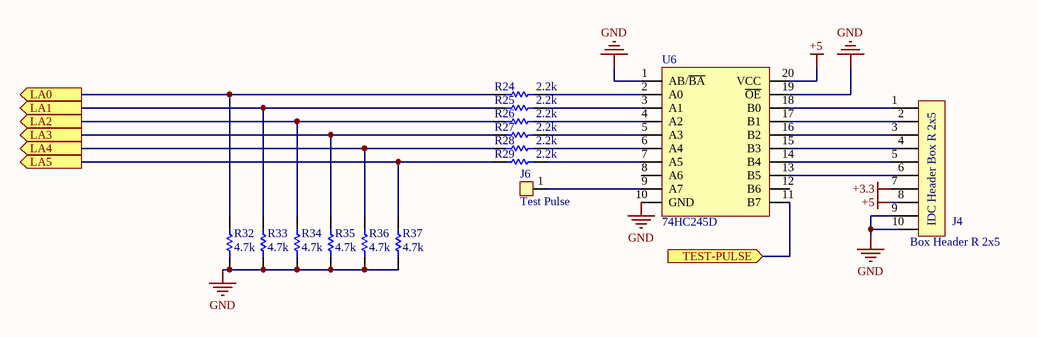
[diagram p5: Buffer.SchDoc]

### Parts
J4  Box Header R 2x5  [HB-R-10]
J6  Test Pulse  [PH-1X1-N3D]
R24  2.2k  [R-0805]
R25  2.2k  [R-0805]
R26  2.2k  [R-0805]
R27  2.2k  [R-0805]
R28  2.2k  [R-0805]
R29  2.2k  [R-0805]
R32  4.7k  [R-0805]
R33  4.7k  [R-0805]
R34  4.7k  [R-0805]
R35  4.7k  [R-0805]
R36  4.7k  [R-0805]
R37  4.7k  [R-0805]
U6  74HC245D  [SOW-20]

### Ports
LA0 (out), LA1 (out), LA2 (out), LA3 (out), LA4 (out), LA5 (out), TEST-PULSE (in)

### Nets
+3.3: J4.7
+5: J4.8 U6.20(VCC)
GND: J4.9 J4.10 R32.2 R33.2 R34.2 R35.2 R36.2 R37.2 U6.1(AB/~{BA}) U6.10(GND) U6.19(~{OE})
NetJ4_1: J4.1 U6.18(B0)
NetJ4_2: J4.2 U6.17(B1)
NetJ4_3: J4.3 U6.16(B2)
NetJ4_4: J4.4 U6.15(B3)
NetJ4_5: J4.5 U6.14(B4)
NetJ4_6: J4.6 U6.13(B5)
NetJ6_1: J6.1 U6.9(A7)
NetR24_1: R24.1 U6.2(A0)
NetR24_2: R24.2 R32.1 ; port LA0
NetR25_1: R25.1 U6.3(A1)
NetR25_2: R25.2 R33.1 ; port LA1
NetR26_1: R26.1 U6.4(A2)
NetR26_2: R26.2 R34.1 ; port LA2
NetR27_1: R27.1 U6.5(A3)
NetR27_2: R27.2 R35.1 ; port LA3
NetR28_1: R28.1 U6.6(A4)
NetR28_2: R28.2 R36.1 ; port LA4
NetR29_1: R29.1 U6.7(A5)
NetR29_2: R29.2 R37.1 ; port LA5
NetU2_27: U6.11(B7) ; port TEST-PULSE

Not connected (* = marked no-connect by the designer): U6 8(A6) 12(B6)

### Notes on the sheet
- Title
- Size:
- Date:
- A4
- Project Number:
- Time:
- Revision:
- Sheet
- of
- Drawn By:
- IOElectro
- File:
- Note:
- (in symbol DS1013-10R) IDC Header Box R 2x5

### Library data of the parts
J4 = DS1013-10R: IDC BOX HEADER RIGHT 2x5 , 2.54MM , 10 Position
J6 = PH-1X1: PIN HEADER 1x1 2.56mm
R24-R29 R32-R37 = RES: 0805
U6 = 74HC245D: 74HC Series 6V Surface Mount 3-State Octal Bus Transceiver - SOIC-20; Manufacturer: Nexperia; Manufacturer Part Number: 74HC245D,653; Supplier 1: Mouser; RoHS: Yes; Category: Buffers, Drivers and Transceivers; Stock 1: 690; Pricing 1: 1=0/60000, 10=0/49300, 50=0/49300, 100=0/38100, 1000=0/25100, 10000=0/24300 (USD); RoHS Compliant: Yes; ComponentLink1URL: http://www.farnell.com/datasheets/2030231.pdf?src-supplier=Farnell; ComponentLink1Description: http://www.farnell.com/datasheets/2030231.pdf?src-supplier=Farnell; Supplier Part Number 1: 771-74HC245D-T

## Nets that join several sheets
+3.3: Power (C15.1 C16.A FB4.1 J2.1), USB (FB1.1), MCU (D4.A J5.1 R42.1), Analog (7 pins), Buffer (J4.7)
+5: Power (8 pins), Buffer (J4.8 U6.20)
+5': Power (C21.1 C22.2 FB3.2), Analog (U5.4)
-5': Power (C19.1 C20.2 C36.K L2.2), Analog (R10.1 U5.11)
GND: Power (18 pins), USB (10 pins), MCU (11 pins), Analog (24 pins), Buffer (11 pins)
VBUS: Power (F1.1), USB (P1.1)
VDD: Power (5 pins), MCU (J1.2 L1.1 U2.1 U2.17)
NetC30_1: MCU (U2.15), Analog (C30.1 D3.K R5.1)
NetQ1_3: MCU (U2.18), Analog (Q1.3 R16.1)
NetR1_2: USB (R1.2), MCU (U2.20)
NetR2_2: USB (R2.2), MCU (U2.19)
NetR21_2: MCU (U2.21), Analog (R21.2)
NetR24_2: MCU (U2.6), Buffer (R24.2 R32.1)
NetR25_2: MCU (U2.7), Buffer (R25.2 R33.1)
NetR26_2: MCU (U2.8), Buffer (R26.2 R34.1)
NetR27_2: MCU (U2.9), Buffer (R27.2 R35.1)
NetR28_2: MCU (U2.10), Buffer (R28.2 R36.1)
NetR29_2: MCU (U2.11), Buffer (R29.2 R37.1)
NetSW1_6: MCU (U2.14), Analog (SW1.6)
NetSW2_6: MCU (U2.13), Analog (SW2.6)
NetSW3_6: MCU (U2.12), Analog (SW3.6)
NetU2_27: MCU (U2.27), Buffer (U6.11)